# EAGLE design usbLoRa (EAGLE 9.6.2)
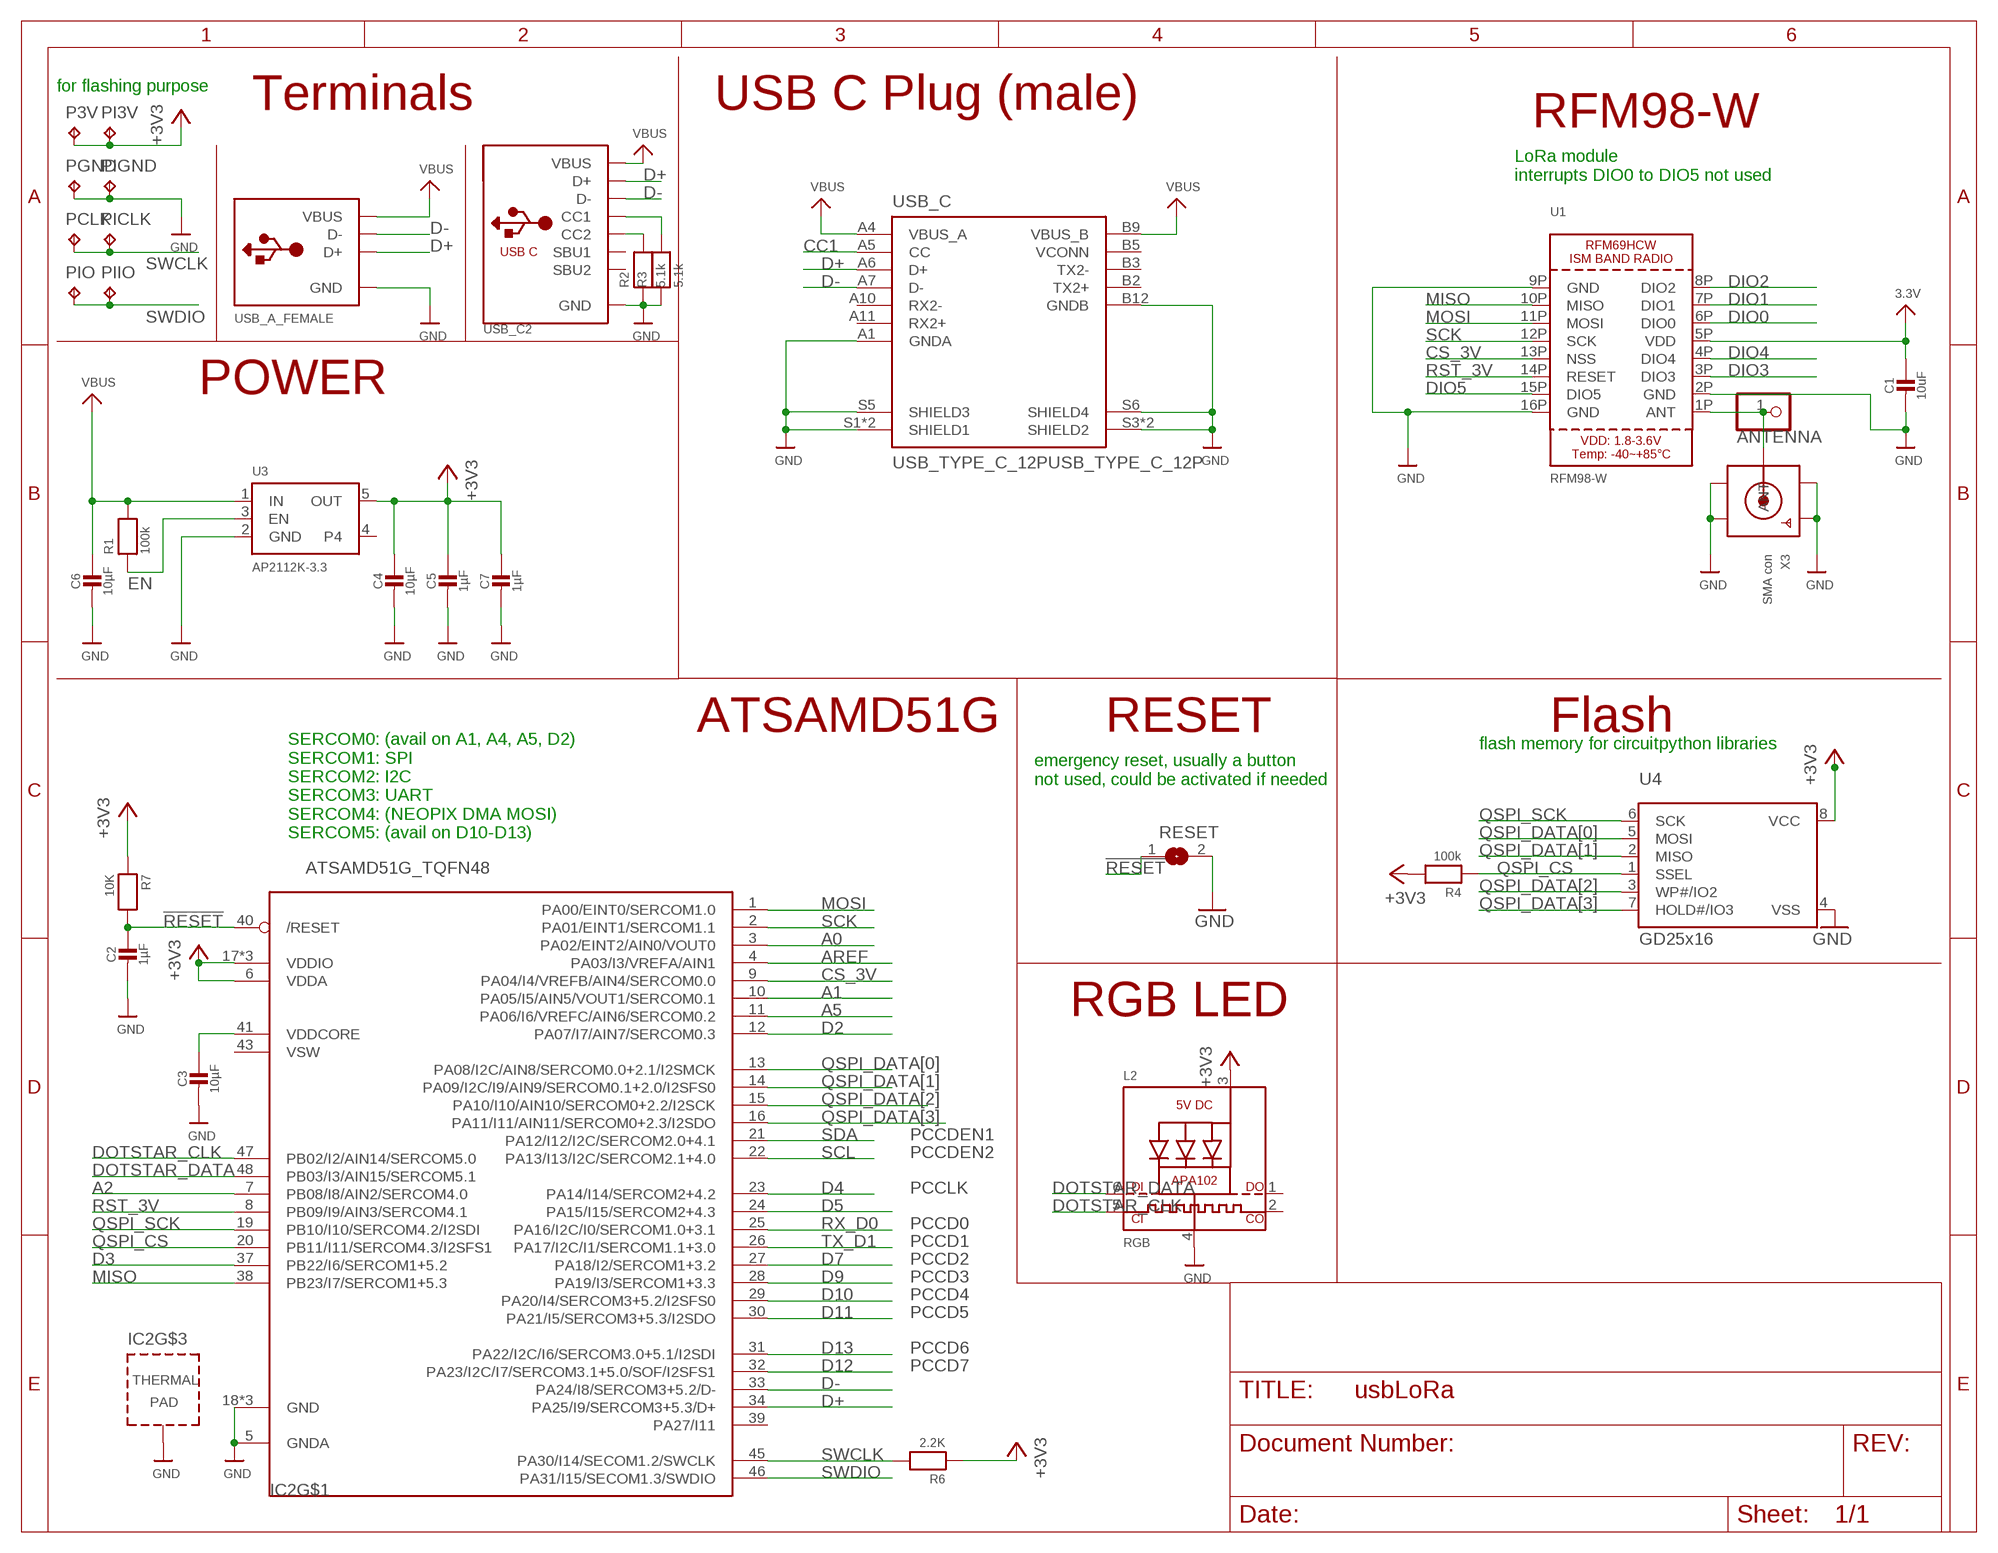
[diagram p0: schematic, sheet 1]

## Parts
ANTENNA  HEADER-1X1ROUND  [1X01_ROUND]
C1  10uF  CAP_CERAMIC0603  [0603@1]
C2  1µF  CAP_CERAMIC0603  [0603@1]
C3  10µF  CAP_CERAMIC0603  [0603@1]
C4  10µF  CAP_CERAMIC0603  [0603@1]
C5  1µF  CAP_CERAMIC0603  [0603@1]
C6  10µF  CAP_CERAMIC0603  [0603@1]
C7  1µF  CAP_CERAMIC0603  [0603@1]
IC2  ATSAMD51G_TQFN48  [TQFN48_7MM]
L2  RGB  APA1022020  [APA102_2020]
P3V  TPTP20R  [TP20R]
PCLK  TPTP20R  [TP20R]
PGND  TPTP20R  [TP20R]
PI3V  TPPAD1-13  [P1-13]
PICLK  TPPAD1-13  [P1-13]
PIGND  TPPAD1-13  [P1-13]
PIIO  TPPAD1-13  [P1-13]
PIO  TPTP20R  [TP20R]
R1  100k  RESISTOR0603  [0603]
R2  5.1k  RESISTOR0603  [0603]
R3  5.1k  RESISTOR0603  [0603]
R4  100k  RESISTOR0603  [0603]
R6  2.2K  RESISTOR0805  [0805]
R7  10K  RESISTOR0805  [0805]
RESET  SOLDERJUMPER  [SOLDERJUMPER_ARROW_NOPASTE]
U1  RFM98-W  RFM69HCW_SMT  [RFMHCW_SMT]
U3  AP2112K-3.3  VREG_SOT23-5  [SOT23-5]
U4  GD25x16  SPIFLASH_8PINUX  [USON8]
USB_A  USB_A_FEMALE  USB_TYPEAPTHFML  [USB_HOST-PTH]
USB_C  USB_TYPE_C_12PUSB_TYPE_C_12P  [USB_TYPE_C_12P]
USB_C2  USB_C  [USB_C_CUSB31-CFM2AX-01-X]
X3  SMA con  SMACONNECTOR_EDGE_UFL  [SMA_EDGELAUNCH_UFL]

## Nets
!RESET: C2.1 IC2.40(/RESET) R7.2 RESET.1
+3V3: C1.1 C4.1 C5.1 C7.1 IC2.6(VDDA) IC2.17(VDDIO) IC2.36(VDDIO) IC2.44(VDDIO) L2.3(VDD) P3V.TP PI3V.TP R4.2 R6.1 R7.1 U1.5P(VDD) U3.5(OUT) U4.8(VCC) ; supply symbol labelled 3.3V
A0: IC2.3(PA02/EINT2/AIN0/VOUT0)
A1: IC2.10(PA05/I5/AIN5/VOUT1/SERCOM0.1)
A2: IC2.7(PB08/I8/AIN2/SERCOM4.0)
A5: IC2.11(PA06/I6/VREFC/AIN6/SERCOM0.2)
AREF: IC2.4(PA03/I3/VREFA/AIN1)
CC1: R3.2 USB_C2.A5(CC1) USB_C.A5(CC)
CS_3V: IC2.9(PA04/I4/VREFB/AIN4/SERCOM0.0) U1.13P(NSS)
D2: IC2.12(PA07/I7/AIN7/SERCOM0.3)
D3: IC2.37(PB22/I6/SERCOM1+5.2)
D4: IC2.23(PA14/I14/SERCOM2+4.2)
D5: IC2.24(PA15/I15/SERCOM2+4.3)
D7: IC2.27(PA18/I2/SERCOM1+3.2)
D9: IC2.28(PA19/I3/SERCOM1+3.3)
D10: IC2.29(PA20/I4/SERCOM3+5.2/I2SFS0)
D11: IC2.30(PA21/I5/SERCOM3+5.3/I2SDO)
D12: IC2.32(PA23/I2C/I7/SERCOM3.1+5.0/SOF/I2SFS1)
D13: IC2.31(PA22/I2C/I6/SERCOM3.0+5.1/I2SDI)
D+: IC2.34(PA25/I9/SERCOM3+5.3/D+) USB_A.D+ USB_C2.A6(D+) USB_C2.B6(D+) USB_C.A6(D+)
D-: IC2.33(PA24/I8/SERCOM3+5.2/D-) USB_A.D- USB_C2.A7(D-) USB_C2.B7(D-) USB_C.A7(D-)
DIO0: U1.6P(DIO0)
DIO1: U1.7P(DIO1)
DIO2: U1.8P(DIO2)
DIO3: U1.3P(DIO3)
DIO4: U1.4P(DIO4)
DIO5: U1.15P(DIO5)
DOTSTAR_CLK: IC2.47(PB02/I2/AIN14/SERCOM5.0) L2.5(CKI)
DOTSTAR_DATA: IC2.48(PB03/I3/AIN15/SERCOM5.1) L2.6(DI)
EN: R1.1 U3.3(EN)
GND: C1.2 C2.2 C3.2 C4.2 C5.2 C6.2 C7.2 IC2.5(GNDA) IC2.18(GND) IC2.35(GND) IC2.42(GND) IC2.THERMAL(TP) L2.4(GND) PGND.TP PIGND.TP R2.1 R3.1 RESET.2 U1.2P(GND) U1.9P(GND) U1.16P(GND) U3.2(GND) U4.4(VSS) USB_A.GND USB_C2.A1B12(GND) USB_C2.B1A12(GND) USB_C.A1(GNDA) USB_C.B12(GNDB) USB_C.S1(SHIELD1) USB_C.S2(SHIELD1) USB_C.S3(SHIELD2) USB_C.S4(SHIELD2) USB_C.S5(SHIELD3) USB_C.S6(SHIELD4) X3.GND@1(GND1) X3.GND@2(GND2) X3.GND@3(GND3) X3.GND@4(GND4)
MISO: IC2.38(PB23/I7/SERCOM1+5.3) U1.10P(MISO)
MOSI: IC2.1(PA00/EINT0/SERCOM1.0) U1.11P(MOSI)
N$1: ANTENNA.1 U1.1P(ANT) X3.P(ANT)
N$10: R2.2 USB_C2.B5(CC2)
QSPI_CS: IC2.20(PB11/I11/SERCOM4.3/I2SFS1) R4.1 U4.1(SSEL)
QSPI_DATA[0]: IC2.13(PA08/I2C/AIN8/SERCOM0.0+2.1/I2SMCK) U4.5(MOSI)
QSPI_DATA[1]: IC2.14(PA09/I2C/I9/AIN9/SERCOM0.1+2.0/I2SFS0) U4.2(MISO)
QSPI_DATA[2]: IC2.15(PA10/I10/AIN10/SERCOM0+2.2/I2SCK) U4.3(WP#/IO2)
QSPI_DATA[3]: IC2.16(PA11/I11/AIN11/SERCOM0+2.3/I2SDO) U4.7(HOLD#/IO3)
QSPI_SCK: IC2.19(PB10/I10/SERCOM4.2/I2SDI) U4.6(SCK)
RST_3V: IC2.8(PB09/I9/AIN3/SERCOM4.1) U1.14P(RESET)
RX_D0: IC2.25(PA16/I2C/I0/SERCOM1.0+3.1)
SCK: IC2.2(PA01/EINT1/SERCOM1.1) U1.12P(SCK)
SCL: IC2.22(PA13/I13/I2C/SERCOM2.1+4.0)
SDA: IC2.21(PA12/I12/I2C/SERCOM2.0+4.1)
SWCLK: IC2.45(PA30/I14/SECOM1.2/SWCLK) PCLK.TP PICLK.TP R6.2
SWDIO: IC2.46(PA31/I15/SECOM1.3/SWDIO) PIIO.TP PIO.TP
TX_D1: IC2.26(PA17/I2C/I1/SERCOM1.1+3.0)
VBUS: C6.1 R1.2 U3.1(IN) USB_A.VBUS USB_C2.A4B9(VBUS) USB_C2.B4A9(VBUS) USB_C.A4(VBUS_A) USB_C.B9(VBUS_B)
VDDCORE1: C3.1 IC2.41(VDDCORE)
Unconnected: IC2.39(PA27/I11) L2.1(DO) L2.2(CKO) U3.4 USB_C2.A8(SBU1) USB_C2.B8(SBU2) USB_C.A10(RX2-) USB_C.A11(RX2+) USB_C.B2(TX2+) USB_C.B3(TX2-) USB_C.B5(VCONN)

## Notes on the sheet
- for flashing purpose
- Terminals | USB C Plug (male)
- RFM98-W
- LoRa module
  interrupts DIO0 to DIO5 not used
- POWER
- ATSAMD51G | RESET | Flash
- flash memory for circuitpython libraries
- emergency reset, usually a button
  not used, could be activated if needed
- SERCOM0: (avail on A1, A4, A5, D2)
  SERCOM1: SPI
  SERCOM2: I2C
  SERCOM3: UART
  SERCOM4: (NEOPIX DMA MOSI)
  SERCOM5: (avail on D10-D13)
- RGB LED
- PCCDEN1
- PCCDEN2
- PCCLK
- PCCD0
- PCCD1
- PCCD2
- PCCD3
- PCCD4
- PCCD5
- PCCD6
- PCCD7

## Power pins joined to a net without a drawn wire
VSW: IC2.43(VSW)

## Library data of the parts
ANTENNA = microbuilder:HEADER-1X1: PIN HEADER
C1-C7 = microbuilder:CAP_CERAMIC: Ceramic Capacitors 0402 - 0402 Surface Mount Capacitors 16pF 50V 5% [Digikey: 445-4899-2-ND] 18pF 50V 5% [Digikey: 490-1281-2-ND] 22pF 50V 5% [Digikey: 490-1283-2-ND] 68pF 50V 5% [Digikey: 490-1289-2-ND] 0.1uF 10V 10% [Digikey: 490-1318-2-ND] 1.0uF 6.3V 10% [Digikey: 490-1320-2-ND] 0603 - 0603 Surface Mount Capacitors 16 pF 50V 5% [Digikey: 445-5051-2-ND] 22 pF 50V [Digikey: PCC220ACVTR-ND] 33 pF 50V 5% [Digikey: 490-1415-1-ND] 56pF 50V 5% [Digikey: 490-1421-1-ND] 220pF 50V 5% [Digikey: 445-1285-1-ND] 680 pF 50V 2200 pF 50V 5% C0G [Digikey: 445-1297-1-ND] 5600 pF 100V 5% X7R [Digikey: 478-3711-1-ND] 0.1 µF 25V 10% [Digikey: PCC2277TR-ND] 0.22 µF 16V 10% X7R [Digikey: 445-1318-1-ND] 1.0 µF 25V 10% [Digikey: 445-5146-2-ND] 0603 - RF Specific 3pF 250V +/-0.1pF RF [Digikey: 712-1347-1-ND] 18 pF 250V 5% [Digikey: 478-3505-1-ND or 712-1322-1-ND] 56 pF 250V 5% C0G RF [Digikey: 490-4867-1-ND] 68 pF 250V RF [Digikey: 490-4868-1-ND] 0805 - 0805 Surface Mount Capacitors 220 pF 250V 2% RF Ceramic Capacitor [Digikey: 712-1398-1-ND] 1000 pF 50V 2% NP0 Ceramic Capacitor [Digikey: 478-3760-1-ND] 0.1 µF 25V 10% Ceramic Capacitor [Digikey: PCC1828TR-ND] 1.0 µF 16V 10% Ceramic Capacitor[Digikey: 490-1691-2-ND] 10.0 µF 10V 10% Ceramic Capacitor[Digikey: 709-1228-1-ND] 10.0 uF 16V 10% Ceramic Capacitor [Digikey: 478-5165-2-ND] 47 uF 6.3V 20% Ceramic Capacitor [Digikey: 587-1779-1-ND or 399-5506-1-ND] 1206 - 1206 Surface Mount Capacitors 47uF 10V 20% Ceramic Capacitor [Digikey: 490-5528-1-ND or 399-5508-1-ND or 445-6010-1-ND] 100uF 6.3V -20%, +80% Y5V Ceramic Capacitor (Digikey: 490-4512-1-ND, Mouser: 81-GRM31CF50J107ZE1L)
IC2 = microbuilder:ATSAMD51G
L2 = microbuilder:APA102: APA102/DotStar Pixels VCC: 5V DC Refresh Rate: 400Hz
P3V PCLK PGND PI3V PICLK PIGND PIIO PIO = testpad:TP: Test pad
R1-R4 R6 R7 = microbuilder:RESISTOR: Resistors 0402 - 0402 Surface Mount Package 22 Ohm 1% 1/16W [Digikey: 311-22.0LRTR-ND] 33 Ohm 5% 1/16W 1.0K 5% 1/16W 1.5K 5% 1/16W 2.0K 1% 1/16W 10.0K 1% 1/16W [Digikey: 311-10.0KLRTR-ND] 10.0K 5% 1/16W [Digikey: RMCF0402JT10K0TR-ND] 12.1K 1% 1/16W [Digikey: 311-22.0LRTR-ND] 100.0K 5% 1/16W 0603 - 0603 Surface Mount Package 0 Ohm 1/10 Watt 1% Resistor 15 Ohm 1/10 Watt 1% Resistor 33 Ohm 1/10 Watt 1% Resistor 49.9 Ohm 1/10 Watt 1% Resistor 100 Ohm 1/10 Watt 1% Resistor 150 Ohm 1/10 Watt 1% Resistor 240 Ohm 1/10 Watt 1% Resistor 390 Ohm 1/10 Watt 1% Resistor 560 Ohm 1/10 Watt 1% Resistor 680 Ohm 1/10 Watt 1% Resistor 750 Ohm 1/10 Watt 1% Resistor 1.0K Ohm 1/10 Watt 1% Resistor 1.5K Ohm 1/10 Watt 1% Resistor 2.0K Ohm 1/10 Watt 1% Resistor 2.2K Ohm 1/10 Watt 1% Resistor 3.3K Ohm 1/10 Watt 1% Resistor 4.7K Ohm 1/10 Watt 1% Resistor 10.0K Ohm 1/10 Watt 1% Resistor 12.0K Ohm 1/10 Watt 1% Resistor 12.1K Ohm 1/10 Watt 1% Resistor 20.0K Ohm 1/10 Watt 1% Resistor 33.0K Ohm 1/10 Watt 1% Resistor 100.0K Ohm 1/10 Watt 1% Resistor 0805 - 0805 Surface Mount Package 0 Ohm 1/8 Watt 1% Resistor 33 Ohm 1/8 Watt 1% Resistor 100 Ohm 1/8 Watt 1% Resistor 150 Ohm 1/8 Watt 1% Resistor 200 Ohm 1/8 Watt 1% Resistor 240 Ohm 1/8 Watt 1% Resistor 330 Ohm 1/8 Watt 1% Resistor 390 Ohm 1/8 Watt 1% Resistor 470 Ohm 1/8 Watt 1% Resistor 1.0K Ohm 1/8 Watt 1% Resistor 1.5K Ohm 1/8 Watt 1% Resistor 2.0K Ohm 1/8 Watt 1% Resistor 4.7K Ohm 1/8 Watt 1% Resistor 5.1K Ohm 1/8 Watt 1% Resistor 5.6K Ohm 1/8 Watt 1% Resistor 10.0K Ohm 1/8 Watt 1% Resistor 22.0K Ohm 1/8 Watt 1% Resistor 33.0K Ohm 1/8 Watt 1% Resistor 100K Ohm 1/8 Watt 1% Resistor 1206 - 1206 Surface Mount Package 2012 - 2010 Surface Mount Package 0.11 Ohm 1/2 Watt 1% Resistor - Digikey: RHM.11UCT-ND
RESET = microbuilder:SOLDERJUMPER: SMD Solder JUMPER Solder the two pads together to create a connection, or remove the solder to break it. REFLOW - Use this footprint for solder paste and reflow ovens. WAVE - Use this footprint for hand-soldering (larger pads). CLOSED - Has a trace between the two pads to ensure it is closed by default. The trace needs to be cut to disable the jumper, and can be closed again by creating a solder bridge between the two pads.; BOM: EXCLUDE
U1 = microbuilder:RFM69HCW: RFM69HCW - ISM Band RF Transceiver
U3 = microbuilder:VREG_SOT23-5: SOT23-5 Fixed Voltage Regulators Part Current Out V Out V In V Dropout θJA (°C/W) TJ (°C) Digikey Part No. ADP121 150mA 3.3V 3.4-5.5V 0.09V @ 150mA -- -- ADP121-AUJZ33R7CT-ND ADP121 150mA 3.0V 3.1-5.5V 0.09V @ 150mA -- -- ADP121-AUJZ30R7CT-ND ADP122 300mA 3.3V 3.4-5.5V 0.085V @ 300mA -- -- ADP122AUJZ-3.3-R7CT-ND ADP1712 300mA 3.3V 3.5-5.5V 0.17V @ 300mA -- -- ADP1712AUJZ-3.3-R7TR-ND AP7311 (Low Cost) 150mA 3.3V 3.5-6V 0.15V @ 150mA -- -- AP7311-33WG-7DICT-ND LD39015M18R 150mA 1.8V 1.9V-5.5V 0.08V @ 100mA -- -- 497-6977-1-ND LP2985A-33DBVR 150mA 3.3V 3.3-16V 0.28V @ 150mA 206 150 296-18479-1-ND MCP1824T-3302E/OT 300mA 3.3V 3.5V-6V 0.2V @ 300mA -- -- MCP1824T-3302E/OTCT-ND MIC5205-2.5YM5 TR 150mA 2.5V 2.7-16V 0.165V @ 150mA -- -- 576-1257-2-ND MIC5205-3.0YM5 TR 150mA 3.0V 3.2V-16V 0.165V @ 150mA -- -- 576-1258-2-ND MIC5205-3.3YM5 TR 150mA 3.3V 3.5V-16V 0.165V @ 150mA -- -- 576-1259-2-ND TPS780330220 150mA 3.3V+2.2V 3.6-5.5V 250mV Max -- -- 296-23332-1-ND TDA3663/N1,135 100mA 3.3V 3.5-45V 0.18V @ 50mA -- -- 568-5343-1-ND Max operating temp can be calculated using θJA, TJ (max junction temperature), and power in watts. Set the "Maximum Ambient Temperature" until it reaches TJ ("Max Junction Temperature"), which is the absolute limit for safe use of the regulator: Heat Sink Temperature Calculator <http://www.daycounter.com/Calculators/Heat-Sink-Temperature-Calculator.phtml> For example, With 12V source into a 3.3V LP2985 and a 30mA load, we are dissipating (12V-3.3V) * 0.03A = 0.261W. With a θJA of 206 °C/W, a TJ of 150°C, and 261mW we can safely use the chip without a heat sink up to 75°C (=147.1°C Junction Temperature).
U4 = microbuilder:SPIFLASH_8PIN: SOIC8 SPI Flash Be careful with the size since SOIC8 flash comes in several 'widths' SOIC8 150 mil M25P16 - 16Mbit (2Mbit x 8) Serial Flash (75MHz SPI Bus), Supply: 2.7-3.6V Digikey: SOIC8 - M25P16-VMN6P-ND SOIC8 208 mil W25Q16BVSSIG - 16Mbit (2Mbit x 8) Serial Flash (104MHz SPI Bus), Supply: 2.7-3.6V Digikey: SOIC8 - W25Q16BVSSIG-ND
USB_A = microbuilder:USB_TYPEA: USB - Type A Connectors Male types stick out and are inserted into a PC or matching females parts (these are the connectors used on USB Memory Sticks, etc.). Female parts are generally used for USB Host and accept a male-type connector. SMT - 4UCON: 10017 PTHFML - Digikey: 609-1045-ND, 4UCon: 05241 PCB - Use 2.0mm thick PCBs with this footprint
USB_C = USB_Type_C_12P:USB_TYPE_C_12P: USB-C (USB TYPE-C) USB 2.0; AVAILABILITY: In Stock; DESCRIPTION: USB-C (USB TYPE-C) USB 2.0; MP: USB_Type_C_12P; PACKAGE: None; PRICE: None; PURCHASE-URL: adafruit.com; XFL: xflconn
USB_C2 = microbuilder:USB_C: USB Type-C USB 2.0 Connector
X3 = microbuilder:SMACONNECTOR: SMA Connector 90° DIP SMA Connector, 50 Ohm (4UConnector: 07259)

## Net classes
1 power: width 0.2 mm

## Board
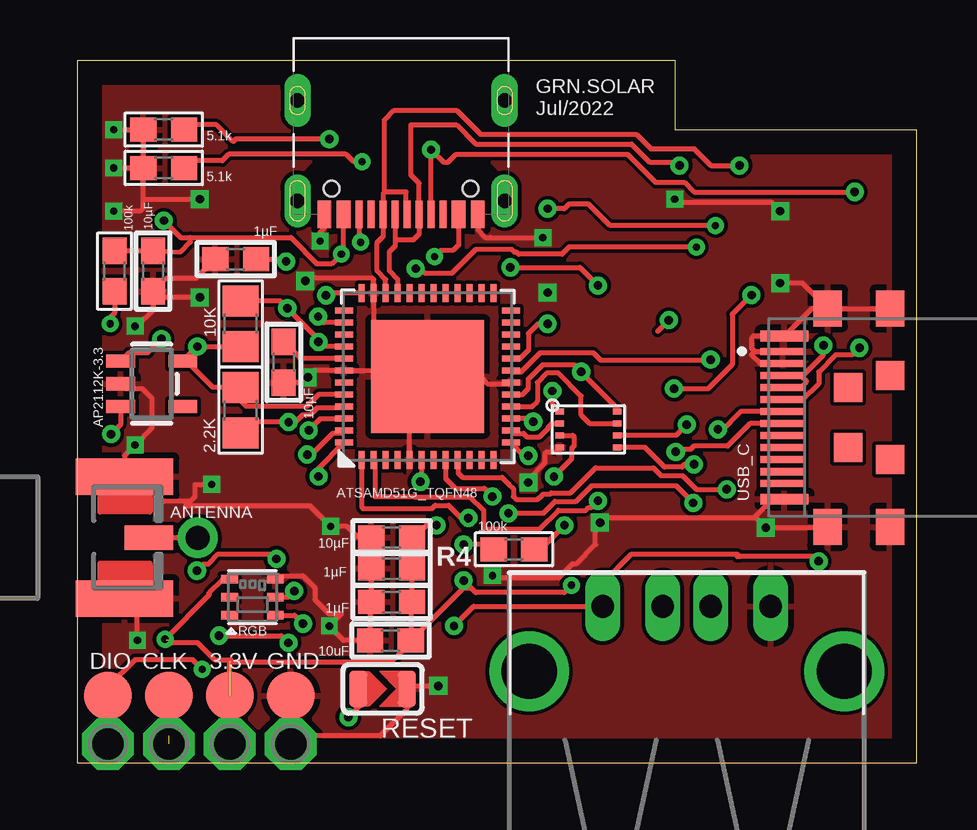
[diagram p1: board, top side]
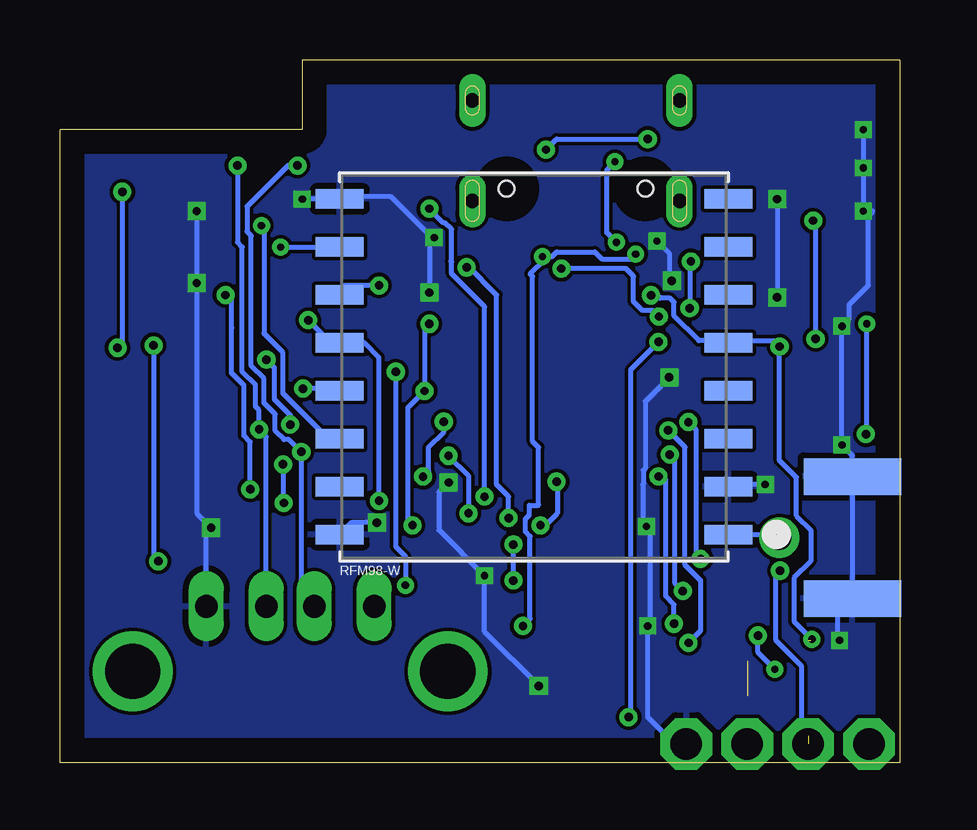
[diagram p2: board, bottom side, seen from below]

Size 35 x 29.3 mm. Coordinates in mm from the lower left corner, seen from the top.
Outline: 0,0 35,0 35,26.4 24.9,26.4 24.9,29.3 0,29.3 0,0
Copper layers (1*16): Top 0.035mm / dielectric 1.5mm / Bottom 0.035mm
Design rules "default *": minimum track width 0.15mm, minimum drill 0.3mm, track to track 6mil, track to pad 6mil, pad to pad 6mil, via to via 6mil, smd to smd 6mil, copper to edge 40mil, drill to drill 6mil, minimum pad ring 10mil, minimum via ring 8mil, stop-mask expansion 4mil, vias tented up to drill 0mil, thermal gap 10mil

### Footprints (pad centres in the part's own frame; a part is rotated, then mirrored left to right if it is on the bottom)
1X01_ROUND = drill 1 pad 1.676: 1 0,0
0603@1 = smd 1.1 x 1: 1 -0.85,0; 2 0.85,0
TQFN48_7MM = smd 0.25 x 0.75: 1 -2.75,-3.475; 2 -2.25,-3.475; 3 -1.75,-3.475; 4 -1.25,-3.475; 5 -0.75,-3.475; 6 -0.25,-3.475; 7 0.25,-3.475; 8 0.75,-3.475; 9 1.25,-3.475; 10 1.75,-3.475; 11 2.25,-3.475; 12 2.75,-3.475; 25 2.75,3.475; 26 2.25,3.475; 27 1.75,3.475; 28 1.25,3.475; 29 0.75,3.475; 30 0.25,3.475; 31 -0.25,3.475; 32 -0.75,3.475; 33 -1.25,3.475; 34 -1.75,3.475; 35 -2.25,3.475; 36 -2.75,3.475 | smd 0.75 x 0.25: 13 3.475,-2.75; 14 3.475,-2.25; 15 3.475,-1.75; 16 3.475,-1.25; 17 3.475,-0.75; 18 3.475,-0.25; 19 3.475,0.25; 20 3.475,0.75; 21 3.475,1.25; 22 3.475,1.75; 23 3.475,2.25; 24 3.475,2.75; 37 -3.475,2.75; 38 -3.475,2.25; 39 -3.475,1.75; 40 -3.475,1.25; 41 -3.475,0.75; 42 -3.475,0.25; 43 -3.475,-0.25; 44 -3.475,-0.75; 45 -3.475,-1.25; 46 -3.475,-1.75; 47 -3.475,-2.25; 48 -3.475,-2.75 | smd 4.7 x 4.7: THERMAL 0,0
APA102_2020 = smd 0.7 x 0.35: 1 -0.95,-0.75; 2 -0.95,0; 3 -0.95,0.75; 4 0.95,0.75; 5 0.95,0; 6 0.95,-0.75
TP20R = smd 2 x 2: TP 0,0
P1-13 = drill 1.321 pad 2.159 octagon: TP 0,0
0603 = smd 1.1 x 1: 1 -0.85,0; 2 0.85,0
0805 = smd 1.3 x 1.5: 1 -0.95,0; 2 0.95,0
SOLDERJUMPER_ARROW_NOPASTE = smd 0.762 x 1.524: 1 -1.016,0; 2 1.016,0
RFMHCW_SMT = smd 2 x 0.8: 1P 8.1,-7; 2P 8.1,-5; 3P 8.1,-3; 4P 8.1,-1; 5P 8.1,1; 6P 8.1,3; 7P 8.1,5; 8P 8.1,7; 9P -8.1,7; 10P -8.1,5; 11P -8.1,3; 12P -8.1,1; 13P -8.1,-1; 14P -8.1,-3; 15P -8.1,-5; 16P -8.1,-7
SOT23-5 = smd 0.55 x 1.2: 1 -0.95,-1.3; 2 0,-1.3; 3 0.95,-1.3; 4 0.95,1.3; 5 -0.95,1.3
USON8 = smd 0.35 x 0.25: 1 -1.2,0.75; 2 -1.2,0.25; 3 -1.2,-0.25; 4 -1.2,-0.75; 5 1.2,-0.75; 6 1.2,-0.25; 7 1.2,0.25; 8 1.2,0.75
USB_HOST-PTH = drill 0.95 long: D+ 1,6.52; D- -1,6.52; GND 3.5,6.52; VBUS -3.5,6.52 | drill 2.3 pad 2.9: S1 -6.57,3.81; S2 6.57,3.81
USB_TYPE_C_12P = smd 0.3 x 1.85: A1 2.74,-0.2; A4 1.24,-0.2; A5 0.74,-0.2; A6 0.24,-0.2; A7 -0.26,-0.2; A10 -1.76,-0.2; A11 -2.27,-0.2; B2 -2.76,-0.2; B3 -1.26,-0.2; B5 -0.76,-0.2; B9 1.74,-0.2; B12 2.24,-0.2 | smd 0.45 x 2: S1 3.39,-0.275; S2 -3.41,-0.275 | smd 1.5 x 1.2: S3 4.54,-2.075; S4 -4.56,-2.075; S5 -4.56,-4.675; S6 4.54,-4.675 | smd 1.2 x 1.2: S7 -1.26,-2.925; S8 1.24,-2.925; S9 -1.76,-4.675; S10 1.74,-4.675
USB_C_CUSB31-CFM2AX-01-X = smd 0.575 x 1.15: A1B12 -3.2,7.355; A4B9 -2.4,7.355; B1A12 3.2,7.355; B4A9 2.4,7.355 | smd 0.275 x 1.15: A5 -1.25,7.355; A6 -0.25,7.355; A7 0.25,7.355; A8 1.25,7.355; B5 1.75,7.355; B6 0.75,7.355; B7 -0.75,7.355; B8 -1.75,7.355 | drill 0.6 pad 1 long: M1 -4.32,6.78; M2 4.32,6.78; M3 -4.32,2.6; M4 4.32,2.6 | hole 0.65: 2.89,6.28; -2.89,6.28
SMA_EDGELAUNCH_UFL = smd 4.064 x 1.524: GND@1 2.032,-2.54; GND@2 2.032,2.54 | smd 4.064 x 1.524 bottom: GND@3 2.032,2.54; GND@4 2.032,-2.54 | smd 2.032 x 1.016: P 3.048,0

### Placement (x,y rotation side)
ANTENNA  5.01,9.38 0 top
C1  13.05,5.1 180 top
C2  6.6,21 180 top
C3  8.6,16.7 270 top
C4  13.1,9.4 180 top
C5  13.1,8.1 180 top
C6  3.15,20.5 270 top
C7  13.1,6.7 180 top
IC2  14.6,16.1 0 top
L2  7.3,6.9 0 top
P3V  6.35,2.79 0 top
PCLK  3.81,2.79 0 top
PGND  8.89,2.79 0 top
PI3V  6.35,0.78 0 top
PICLK  3.81,0.78 0 top
PIGND  8.89,0.78 0 top
PIIO  1.27,0.78 0 top
PIO  1.27,2.79 0 top
R1  1.55,20.5 90 top
R2  3.6,24.8 0 top
R3  3.6,26.4 0 top
R4  18.2,8.9 180 top
R6  6.8,14.7 270 top
R7  6.8,18.3 90 top
RESET  12.72,3.08 0 top
U1  15.24,16.51 0 bottom
U3  3.1,15.8 270 top
U4  21.3,13.9 0 top
USB_A  25.4,0 0 top
USB_C  29.2,14.4 90 top
USB_C2  13.49,30.21 180 top
X3  -0.07,9.39 0 top

### Tracks (layer width: path | path; a pad name or v marks a point on that pad's centre or on a via)
!RESET  (via drill 0.35)
  Top 0.2: 11.73,3.1 RESET.1 | RESET.1 11.63,3 | IC2.40 10.25,17.35 v10.05,17.55 10.05,17.65 v8.75,18.95 8.45,19.25 R7.2 | C2.1 8.6,21 v8.7,20.9 | RESET.1 11.7,2.3 v11.3,1.9
  Bottom 0.2: v8.7,20.9 8.75,20.85 v8.75,18.95 | v11.3,1.9 11.2,2 11.2,16.39 v10.05,17.55
+3V3  (via drill 0.3, 0.35)  (2 unrouted)
  Top 0.2: v20.6,7.4 20.3,7.1 16.6,7.1 16.4,7.3 | 16.4,7.3 v16.1,7.6 | v3.65,5.15 3.7,5.1 | P3V.TP 6.35,1.12 | PI3V.TP P3V.TP | P3V.TP 6.35,4.2 13.1,4.2 13.9,5 C1.1 | 6.35,4.25 6.4,4.3 5.71,4.3 5.01,5.01 3.89,5.01 3.75,5.15 v3.65,5.15 | 3.79,5.11 3.91,4.99 | 17.4,8.9 R4.2 17.15,9.1 v16.1,9.1 | L2.3 6.05,7.65 5.5,7.1 5.5,7 v3.65,5.15 | U3.5 4.47,16.82 | 4.47,16.82 v5,17.35 R7.1 | IC2.36 10.47,19.57 10.38,19.48 v10.36,19.48 | 6.95,15.8 R6.1 | R6.1 6.8,15.1 7.05,14.85 9.55,14.85 10.05,15.35 IC2.44 | R6.1 5.65,15.65 4.47,16.82 | 16.4,7.3 16.1,7.3 C1.1 | 14.35,9.8 C4.1 13.95,9.3 | 13.95,9.3 C5.1 C7.1 13.9,6.65 C1.1 | U4.8 22.5,14.8 v21,16.3 20.7,16.6 19.4,16.6 18.8,16 18.8,15.6 18.55,15.35 IC2.17 | IC2.6 14.35,11.77 v14.3,11.72 | v14.97,9.9 14.55,9.9 13.95,9.3
  Bottom 0.2: v20.6,7.4 20.6,8.6 21,9 v21,16.3 | v3.65,5.15 4.4,5.9 4.4,7.7 3.7,8.4 3.7,9.7 4.3,10.3 4.3,11.9 5,12.6 v5,17.35 5.25,17.6 7.05,17.6 U1.5P 7.23,17.6 8.37,17.6 9.4,18.63 9.4,19.2 9.56,19.36 9.98,19.36 10.1,19.48 v10.36,19.48 | v16.1,7.6 v16.1,9.1 | v14.97,9.9 14.77,9.9 14.27,10.4 14.27,11.69 v14.3,11.72
CC1  (via drill 0.35)
  Top 0.2: USB_C2.A5 v14.74,25.56 15.26,25.04 15.46,25.04 15.78,25.37 22.93,25.37 24.1,24.2 25.3,24.2 25.7,23.8 v32.4,23.8 | R3.2 4.65,26.6 5.8,26.6 6.5,25.9 6.6,26 v10.5,26 | v32.6,17.3 32.3,17 31.6,17 30.9,16.3 30.9,15.8 30.2,15.1 29.44,15.1 USB_C.A5
  Bottom 0.2: v10.5,26 14.3,26 v14.74,25.56 | v32.6,17.3 32.4,17.5 v32.4,23.8
CS_3V  (via drill 0.35)
  Top 0.2: IC2.9 15.87,12.6 15.87,12.08 16.05,11.9 17.7,11.9 18,11.6 | 18,11.6 17.97,11.6 | 18,11.6 18.17,11.43 18.17,11.09 18.28,10.98 19.18,10.98 19.25,11.05 19.28,11.05 19.43,11.2 19.7,11.2 19.75,11.25 20.55,11.25 21.6,12.3 24,12.3 24.32,11.98 25.22,11.98 25.8,11.4 v27.07,11.4 | v24.87,15.6 26.3,15.6 27.3,16.6 27.3,18.7 v28.1,19.5
  Bottom 0.2: 24.11,15.51 U1.13P 23.43,15.6 v24.87,15.6 | 27.83,18.13 27.85,18.15 | v28.1,19.5 27.85,19.25 27.85,18.15 | v27.07,11.4 27.07,13.38 27.33,13.64 27.33,15.73 27.85,16.25 27.85,18.15
D+  (via drill 0.35)
  Top 0.2: USB_C2.A6 13.7,22.89 13.7,23.8 12.8,23.8 | 12.8,23.8 12.74,23.74 USB_C2.B6 12.74,21.94 12.49,21.69 12.49,20.51 12.85,20.15 IC2.34 | v26.7,13.9 26.8,13.8 27.64,14.64 USB_C.A6 | 12.8,23.8 12.8,26.8 13.2,27.2 15.8,27.2 16.8,26.2 23.3,26.2 23.9,25.6 25.7,25.6 26.4,24.9 v27.6,24.9
  Bottom 0.2: USB_A.D+ 26.4,13.6 v26.7,13.9 26.7,14.7 26.85,14.85 26.85,15.75 27.4,16.3 27.4,21.5 27.6,21.7 v27.6,24.9
D-  (via drill 0.35)
  Top 0.2: USB_C2.A7 13.24,21.9 | 13.24,21.9 13.24,21.54 12.99,21.29 12.99,20.51 13.35,20.15 IC2.33 | 13.24,21.9 13.34,21.8 14,21.8 14.24,22.04 USB_C2.B7 14.24,24.16 13.9,24.5 13.9,26.6 15.8,26.6 16.6,25.8 23.1,25.8 23.85,25.05 24.95,25.05 v25.1,24.9 | v24.94,12.96 25.05,13.07 25.56,13.07 25.69,13.2 27.1,13.2 28.04,14.14 USB_C.A7
  Bottom 0.2: USB_A.D- 24.94,7.06 v24.94,12.96 25.45,13.47 25.66,13.47 26.03,13.84 26.03,14.53 26.5,15 26.5,16.02 27.03,16.54 27.03,21.97 27.21,22.15 27.21,23.19 25.5,24.9 v25.1,24.9
DOTSTAR_CLK  (via drill 0.35)
  Top 0.2: IC2.47 11,13.73 10.64,13.73 9.77,12.85 v9.58,12.85 | v9.04,7.16 8.9,7.03 8.9,7 8.8,6.9 L2.5
  Bottom 0.2: v9.58,12.85 9.38,12.65 9.38,7.5 v9.04,7.16
DOTSTAR_DATA  (via drill 0.35)
  Top 0.2: L2.6 9.05,6.15 v9.4,5.8 | v10.05,11.93 10.05,12.27 IC2.48
  Bottom 0.2: v9.4,5.8 9.4,6.6 9.75,6.95 9.75,11.81 9.96,12.02 v10.05,11.93
EN  (via drill 0.3, 0.35)
  Top 0.2: R1.1 1.55,18.75 1.2,18.4 1.3,18.3 v1.37,18.3 | U3.3 1.8,14.1 v1.4,13.7
  Bottom 0.2: v1.4,13.7 1.37,13.73 v1.37,18.3
GND  (via drill 0.3, 0.35)
  Top 0.2: USB_C2.A1B12 16.7,22.84 16.7,22.2 17,21.9 17.2,21.9 17.21,21.89 19.59,21.89 19.58,21.9 v19.4,21.9 | USB_C2.B1A12 10.29,22.29 9.9,21.9 10.05,21.75 v10.11,21.75 | 3.15,19.4 C6.2 3.7,20.2 4.95,20.2 C2.2 | 3.15,19.4 3.15,18.85 2.5,18.2 v2.4,18.2 2.5,18.3 | v1.52,23 2.63,23 2.75,23.12 2.75,23.5 | v2.5,5.1 2.5,6.31 | 2.5,6.31 2.5,6.9 | X3.GND@4 2.5,6.31 | R2.1 v1.52,24.8 1.5,24.8 | v1.52,26.4 R3.1 R2.1 | 4.7,10.9 3.6,10.9 2.57,11.93 X3.GND@3 1.96,12.81 v2.4,13.25 3.1,13.95 3.1,15.2 2.7,15.6 2,15.6 U3.2 | 4.7,10.9 4.5,10.7 9.7,10.7 v10.55,9.85 11.25,9.85 11.7,9.4 C4.2 | 4.7,10.9 4.9,11.1 4.9,11.6 v5.6,11.6 | RESET.2 13.98,3.08 | PIGND.TP 8.89,1.12 | 8.89,1.12 PGND.TP | 13.15,2.5 RESET.2 | RESET.2 13.86,3.2 v15.04,3.2 | v17.3,7.8 17.4,7.8 17.5,7.7 20.04,7.7 20.64,8.3 20.8,8.3 21.6,9.1 21.6,10 21.61,10.01 v21.79,10.01 21.98,10.2 28.2,10.2 | RESET.2 13.74,2.24 12.62,1.12 8.89,1.12 | L2.4 8.4,7.8 9.4,7.8 9.9,7.3 9.9,6.8 10.5,6.2 11,6.2 v10.5,5.7 11.1,5.1 C1.2 12.2,6.65 C7.2 C5.2 C4.2 | v9.49,20.09 9.6,20.2 12.3,20.2 12.35,20.15 IC2.35 12.35,18.45 14.2,16.6 14.2,16.1 | C3.2 9.35,15.85 9.65,16.15 | 9.65,16.15 9.85,16.35 IC2.42 13.35,16.35 13.6,16.1 14.2,16.1 | 14.2,16.1 14.3,16.1 | 14.3,16.1 IC2.THERMAL 16.8,16.1 17.1,15.8 18.02,15.8 IC2.18 | 12.4,9.4 C4.2 | IC2.5 13.85,15.65 14.3,16.1 | U4.4 20.1,12.96 19.56,12.96 19.5,12.9 19.5,12.5 18.8,11.8 v18.8,11.69 | 9.65,16.15 9.65,16.11 v9.6,16.06 | 2.75,23.5 R2.1 | 2.75,23.5 v5.1,23.5 | v5.1,19.4 3.15,19.4 | USB_C.S4 31.23,9.8 v28.7,9.8 28.3,10.2 28.2,10.2 | USB_C.S2 28.99,10.99 28.2,10.2 | USB_C.S3 30.62,18.94 USB_C.S1 28.19,17.79 28.1,17.7 28.1,17.28 28.24,17.14
  Top 0.2: USB_C.S3 USB_C.S6 | USB_C.S3 30.21,20 v29.3,20 | 29.46,16.7 USB_C.B12 28.46,16.64 28.1,17 28.24,17.14 | 28.24,17.14 USB_C.A1 | v24.9,23.5 25.05,23.35 28.95,23.35 v29.3,23
  Bottom 0.2: v10.11,21.75 9.6,21.24 9.6,20.1 | v2.5,5.1 2.6,5.1 2.6,6.21 X3.GND@4 X3.GND@3 1.96,12.81 v2.4,13.25 v2.4,18.2 2.1,18.5 2.1,19.1 1.3,19.9 1.3,22.8 1.12,22.98 1.12,23 v1.52,23 v1.52,24.8 v1.52,26.4 | v5.6,11.6 7.05,11.6 U1.2P | v24.9,23.5 v24.91,23.51 U1.9P 23.25,23.6 21.2,23.6 19.5,21.9 v19.4,21.9 19.6,21.7 v19.6,19.6 | v15.04,3.2 17.3,5.46 v17.3,7.8 19.2,9.7 19.2,11.28 v18.8,11.69 | 23.6,9.25 U1.16P 22.84,10.01 v21.79,10.01 | PIGND.TP 9.38,0.78 10.5,1.9 v10.5,5.7 10.4,5.8 10.4,9.7 v10.55,9.85 10.7,10 10.7,11.6 10.68,11.62 10.68,12.2 10.6,12.27 10.6,15.06 v9.6,16.06 | USB_A.GND 28.9,9.6 v28.7,9.8 29.3,10.4 v29.3,20 | 29.2,20 v29.3,20 | v5.1,23.5 v5.1,19.4 | v29.3,23 v29.3,20
  pour Top: 0,0 0,29.3 35,29.3 35,0
  pour Bottom: 0,0 0,29.3 35,29.3 35,0
MISO  (via drill 0.3, 0.35)
  Top 0.2: IC2.38 10.28,18.35 v10.03,18.6 | v14.1,20.6 14.3,20.6 14.5,20.4 15.6,20.4 16.6,21.4 18.1,21.4 18.21,21.29 18.31,21.29 18.39,21.2 20.2,21.2 20.5,21.5 v25.8,21.5
  Bottom 0.2: v25.8,21.5 U1.10P | v10.03,18.6 10.29,18.85 10.72,18.85 11.09,19.22 11.09,20.29 11.4,20.6 v14.1,20.6
MOSI  (via drill 0.35)
  Top 0.2: IC2.1 11.85,10.65 11.9,10.6 14.78,10.6 14.91,10.73 15.47,10.73 16,10.2 v16.3,10.2 | v18.05,20.65 20.95,20.65 v21.7,19.9
  Bottom 0.2: U1.11P 23.5,19.51 23.11,19.9 v21.7,19.9 | v16.3,10.2 16.3,11.1 16.8,11.6 16.8,19.5 18,20.7 v18.05,20.65
N$1
  Top 0.2: X3.P ANTENNA.1
  Bottom 0.2: U1.1P 5.14,9.51 ANTENNA.1
N$10  (via drill 0.3)
  Top 0.2: USB_C2.B5 11.74,21.76 v11.8,21.7 | v11.86,25.06 11.51,25.06 11.2,25.37 6.3,25.37 6.03,25.1 4.75,25.1 R2.2
  Bottom 0.2: v11.8,21.7 12.2,22.1 12.2,24.7 11.86,25.04 v11.86,25.06
QSPI_CS  (via drill 0.35)
  Top 0.2: R4.1 19.31,8.9 v20.3,9.9 | U4.1 19.8,14.95 v19.8,15.5 | v19.6,18.3 19.2,18.3 18.8,17.9 18.8,17.2 18.45,16.85 IC2.20
  Bottom 0.2: v20.3,9.9 20.49,10.09 20.49,14.81 v19.8,15.5 19.8,18.1 v19.6,18.3
QSPI_DATA[0]  (via drill 0.35)
  Top 0.2: v18.8,12.8 18.62,12.8 IC2.13 | v17.97,10.4 19.4,10.4 19.9,10.9 20.79,10.9 21.44,11.55 24.95,11.55 v25.67,10.83 | v25.7,12.44 25.31,12.44 25.2,12.33 24.47,12.33 23.65,13.15 U4.5
  Bottom 0.2: v17.97,10.4 17.97,11.97 v18.8,12.8 | v25.67,10.83 25.67,12.4 v25.7,12.44
QSPI_DATA[1]
  Top 0.2: IC2.14 18.2,13.73 18.6,13.73 18.74,13.59 19.26,13.59 19.63,13.96 19.63,14 19.78,14.15 U4.2
QSPI_DATA[2]  (via drill 0.35)
  Top 0.2: v19,14.22 18.87,14.35 IC2.15 | U4.3 20.65,13.65 20.7,13.6 20.7,13.21 20.6,13.11 20.6,12.67 v19.86,11.93
  Bottom 0.2: v19,14.22 19,13.8 19.63,13.17 19.63,12.16 v19.86,11.93
QSPI_DATA[3]
  Top 0.2: IC2.16 18.95,14.85 | 18.94,14.86 18.95,14.85 | 18.95,14.85 19.17,15.07 19.17,15.86 19.56,16.25 20.05,16.25 21,15.3 21,14.5 21.35,14.15 U4.7
QSPI_SCK  (via drill 0.35)
  Top 0.2: v25.4,14.1 24.95,13.65 U4.6 | IC2.19 18.12,16.3 18.5,16.3 19.3,17.1 21.5,17.1 21.8,16.8 v26.39,16.8 v26.4,16.8
  Bottom 0.2: v25.4,14.1 25.4,14.5 26.05,15.15 26.05,16.46 v26.4,16.8
RST_3V  (via drill 0.3, 0.35)
  Top 0.2: 26.5,22.3 v26.6,22.4 22.2,22.4 21.3,23.3 20.5,23.3 20.3,23.1 v19.6,23.1 | IC2.8 15.35,11.85 15.76,11.44 16.96,11.44 v17.3,11.1
  Bottom 0.2: v26.6,22.4 26.5,22.3 26.5,17.9 25.7,17.1 25.7,15.4 24.01,13.71 23.54,13.71 U1.14P | 18.68,20.88 18.68,20.39 17.3,19.02 v17.3,11.1 | 18.68,20.88 18.7,20.9 | v19.6,23.1 19.01,22.51 18.94,22.51 18.68,22.24 18.68,20.88
SCK  (via drill 0.35)
  Top 0.2: 24.19,17.99 v24.65,18.45 | IC2.2 12.4,12.57 12.4,11.1 14.03,11.1 14.04,11.09 16.37,11.09 16.93,10.53 16.93,9.75 19.27,9.75 20.04,10.53 21.19,10.53 21.3,10.64 21.42,10.64 v21.7,10.92
  Bottom 0.2: v24.65,18.45 23.71,17.51 U1.12P 22.31,17.51 21.7,16.9 v21.7,10.92
SWCLK  (via drill 0.35)  (1 unrouted)
  Top 0.2: PCLK.TP 3.81,1.12 | v4.98,8.01 5.26,8.29 5.46,8.29 5.87,8.7 8.1,8.7 v8.3,8.5 | R6.2 7.25,14.2 v8.8,14.2 9.09,14.2 9.39,14.5 9.7,14.5 10,14.8 11.07,14.8 IC2.45
  Bottom 0.2: 3.47,1.12 3.81,1.12 4.1,1.41 4.1,4.04 5.15,5.1 5.15,7.84 v4.98,8.01 | PICLK.TP 3.47,1.12 | 3.47,1.12 3.4,1.12 | v8.8,14.2 8.5,13.9 8.5,8.7 v8.3,8.5
SWDIO  (via drill 0.3, 0.35)
  Top 0.2: v5.2,3.9 4.8,4.3 2.4,4.3 1.27,3.17 PIO.TP PIIO.TP | v5.9,5.3 8.5,5.3 v8.8,5 | v9.64,13.86 10.13,14.35 IC2.46
  Bottom 0.2: 5.1,3.8 v5.2,3.9 5.9,4.6 v5.9,5.3 5.9,5.6 | v8.8,5 8.3,5.5 8.3,7.61 8.95,8.25 8.95,13.16 v9.64,13.86
VBUS  (via drill 0.3, 0.35)
  Top 0.2: USB_C2.A4B9 15.89,21.61 15.9,21.6 15.65,21.35 15.15,21.35 15,21.2 15,21.1 v14.88,21.1 | 11.09,21.21 v11,21.21 | 11.09,21.12 USB_C2.B4A9 | R1.2 C6.1 4.3,21.3 4.7,21.7 4.7,21.9 | v11,21.21 11.09,21.12 | 11.09,21.12 11.09,21.1 | v11,21.21 10.59,20.8 10,20.8 8.9,21.9 4.7,21.9 | U3.1 2.15,17.1 2.93,17.1 v3.5,17.67 | v3.6,22.6 4.3,21.9 4.7,21.9 | v15.7,5.7 16.52,6.52 USB_A.VBUS 21.9,7.5 23.1,8.7 27.5,8.7 27.6,8.6 | USB_C.A4 30.14,15.64 30.4,15.9 30.16,16.14 USB_C.B9 30.24,16.14 31.1,17 v31.1,17.4 | v30.9,8.4 30.7,8.6 27.6,8.6 | 27.6,8.6 27.5,8.6
  Bottom 0.2: v11,21.21 11,21 12.4,21 12.7,21.3 14.3,21.3 14.5,21.1 v14.88,21.1 14.78,21 15.4,20.38 15.3,20.28 15.3,13.4 15.05,13.15 15.05,10.75 15.07,10.73 15.43,10.73 15.43,10.33 15.6,10.16 15.6,9.64 15.4,9.44 15.4,6 v15.7,5.7 | v3.5,17.67 3.5,22.5 v3.6,22.6 | v30.9,8.4 31.1,8.6 v31.1,17.4
VDDCORE1
  Top 0.2: IC2.41 9.3,16.85 C3.1

### Text on the board
tNames: GRN.SOLAR / Jul/2022 | DIO | CLK | 3.3V | GND